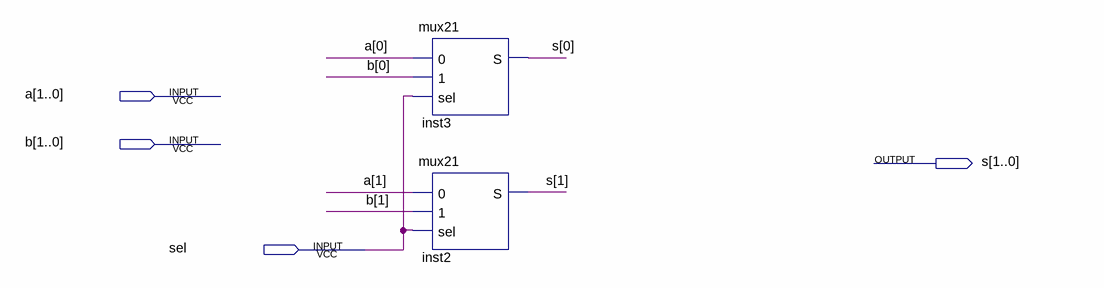
[diagram p0: schematic sheet]
// Quartus schematic mux21_2b.bdf as structural Verilog: 2 symbols, 4 pins
module mux21_2b (
  input  [1:0] a,
  input  [1:0] b,
  input  sel,
  output [1:0] s
);

  mux21 inst3 (.\0 (a[0]), .\1 (b[0]), .sel(sel), .S(s[0]));
  mux21 inst2 (.\0 (a[1]), .\1 (b[1]), .sel(sel), .S(s[1]));
endmodule
